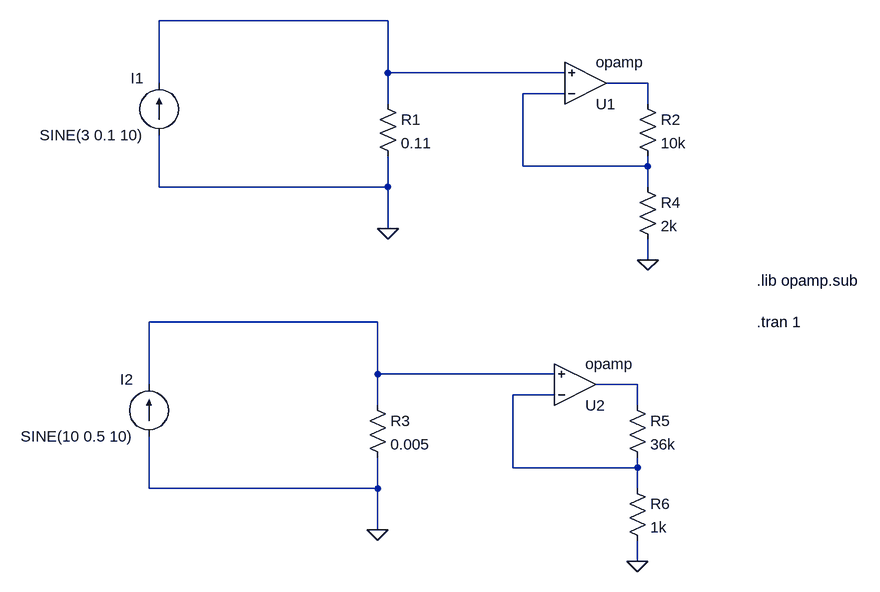
[diagram p0: schematic Current measure.asc]
Current measure.asc, the LTspice schematic file:
Version 4
SHEET 1 880 868
WIRE -16 16 -368 16
WIRE -16 96 -16 16
WIRE 256 96 -16 96
WIRE -368 112 -368 16
WIRE 384 112 320 112
WIRE 256 128 192 128
WIRE -16 144 -16 96
WIRE 384 144 384 112
WIRE 192 240 192 128
WIRE 384 240 384 224
WIRE 384 240 192 240
WIRE -368 272 -368 192
WIRE -16 272 -16 224
WIRE -16 272 -368 272
WIRE 384 272 384 240
WIRE -16 336 -16 272
WIRE 384 384 384 352
WIRE -32 480 -384 480
WIRE -32 560 -32 480
WIRE 240 560 -32 560
WIRE -384 576 -384 480
WIRE 368 576 304 576
WIRE 240 592 176 592
WIRE -32 608 -32 560
WIRE 368 608 368 576
WIRE 176 704 176 592
WIRE 368 704 368 688
WIRE 368 704 176 704
WIRE -384 736 -384 656
WIRE -32 736 -32 688
WIRE -32 736 -384 736
WIRE 368 736 368 704
WIRE -32 800 -32 736
WIRE 368 848 368 816
FLAG 384 384 0
FLAG -16 336 0
FLAG 368 848 0
FLAG -32 800 0
SYMBOL Opamps\\opamp 288 176 M180
SYMATTR InstName U1
SYMBOL res -32 128 R0
SYMATTR InstName R1
SYMATTR Value 0.11
SYMBOL res 368 128 R0
SYMATTR InstName R2
SYMATTR Value 10k
SYMBOL res 368 256 R0
SYMATTR InstName R4
SYMATTR Value 2k
SYMBOL current -368 192 R180
WINDOW 0 24 88 Left 0
WINDOW 3 24 0 Left 0
WINDOW 123 0 0 Left 0
WINDOW 39 0 0 Left 0
SYMATTR InstName I1
SYMATTR Value SINE(3 0.1 10)
SYMBOL Opamps\\opamp 272 640 M180
SYMATTR InstName U2
SYMBOL res -48 592 R0
SYMATTR InstName R3
SYMATTR Value 0.005
SYMBOL res 352 592 R0
SYMATTR InstName R5
SYMATTR Value 36k
SYMBOL res 352 720 R0
SYMATTR InstName R6
SYMATTR Value 1k
SYMBOL current -384 656 R180
WINDOW 0 24 88 Left 0
WINDOW 3 24 0 Left 0
WINDOW 123 0 0 Left 0
WINDOW 39 0 0 Left 0
SYMATTR InstName I2
SYMATTR Value SINE(10 0.5 10)
TEXT 552 416 Left 0 !.lib opamp.sub
TEXT 552 480 Left 0 !.tran 1

The netlist it stands for:
* Current measure.asc
XU1 N003 N001 N002 opamp Aol=100K GBW=10Meg  ; pins invin noninvin out
R1 N001 0 0.11
R2 N002 N003 10k
R4 N003 0 2k
I1 0 N001 SINE(3 0.1 10)
XU2 N006 N004 N005 opamp Aol=100K GBW=10Meg  ; pins invin noninvin out
R3 N004 0 0.005
R5 N005 N006 36k
R6 N006 0 1k
I2 0 N004 SINE(10 0.5 10)
.lib opamp.sub
.tran 1
.backanno
.end